# Altium schematic sheet 1_PowerSupply.SchDoc
size A4
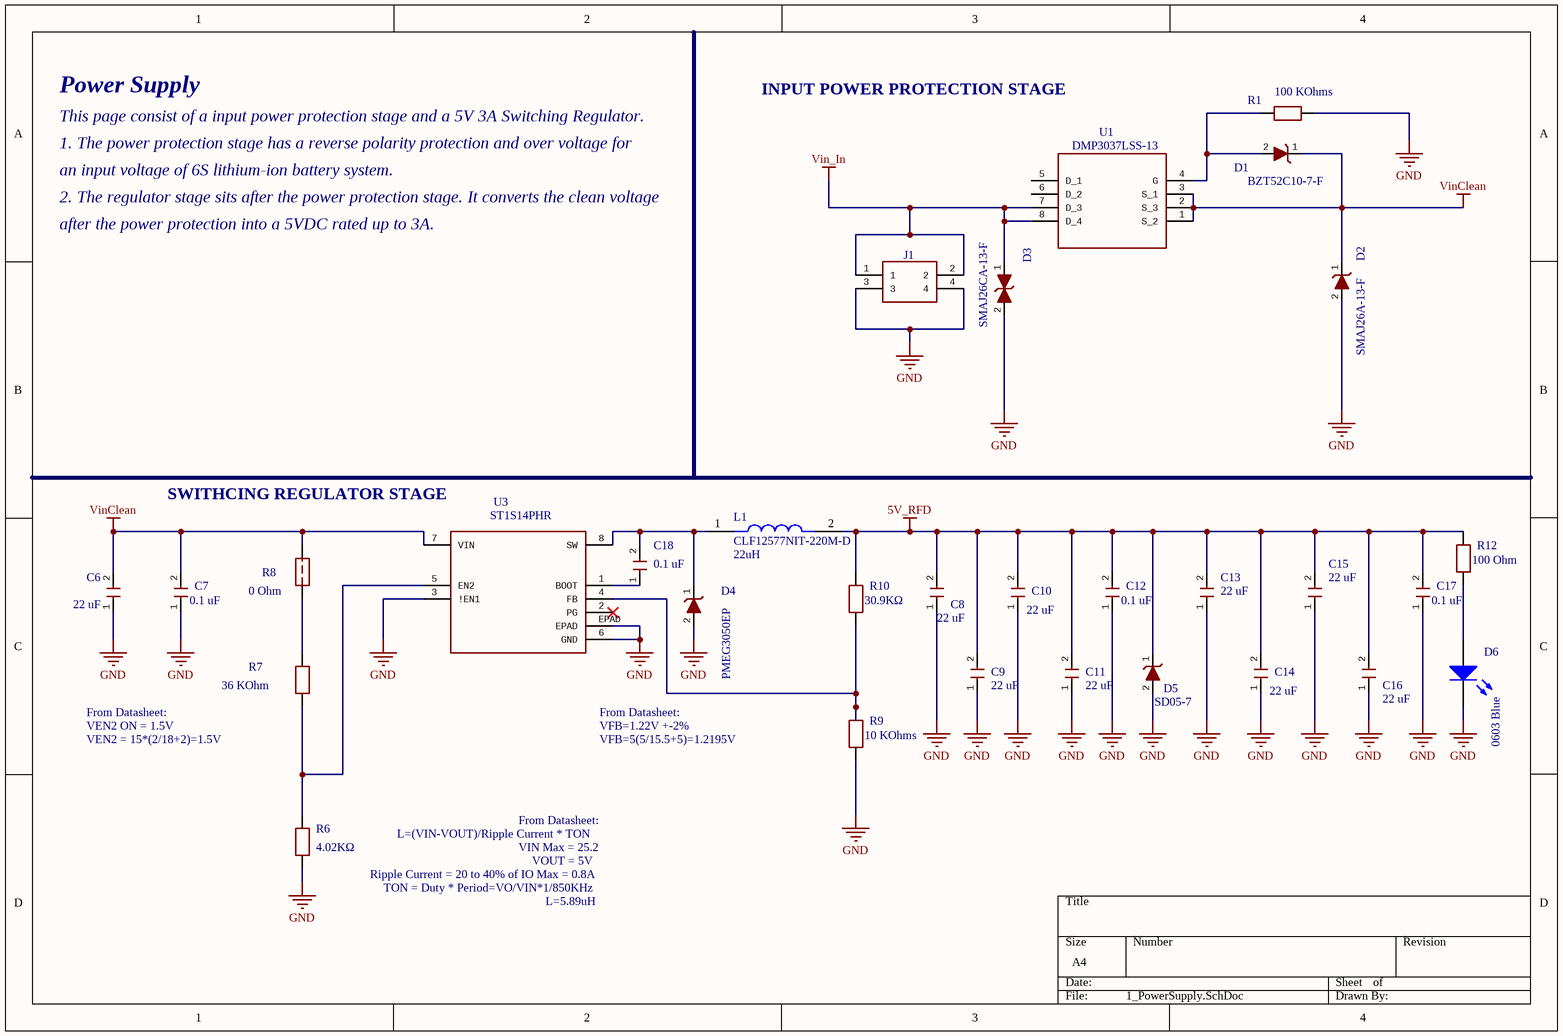
[diagram p0: 1_PowerSupply.SchDoc]

## Parts
C6  value 22 uF  [CAP_0805]  (hidden comment: C2012X5R1V226MT000E)
C7  value 0.1 uF  [CAP_0603]  (hidden comment: CL10B104KB8NNNC)
C8  value 22 uF  [CAP_0805]  (hidden comment: C2012X5R1V226MT000E)
C9  value 22 uF  [CAP_0805]  (hidden comment: C2012X5R1V226MT000E)
C10  value 22 uF  [CAP_0805]  (hidden comment: C2012X5R1V226MT000E)
C11  value 22 uF  [CAP_0805]  (hidden comment: C2012X5R1V226MT000E)
C12  value 0.1 uF  [CAP_0603]  (hidden comment: CL10B104KB8NNNC)
C13  value 22 uF  [CAP_0805]  (hidden comment: C2012X5R1V226MT000E)
C14  value 22 uF  [CAP_0805]  (hidden comment: C2012X5R1V226MT000E)
C15  value 22 uF  [CAP_0805]  (hidden comment: C2012X5R1V226MT000E)
C16  value 22 uF  [CAP_0805]  (hidden comment: C2012X5R1V226MT000E)
C17  value 0.1 uF  [CAP_0603]  (hidden comment: CL10B104KB8NNNC)
C18  value 0.1 uF  [CAP_0603]  (hidden comment: CL10B104KB8NNNC)
D1  BZT52C10-7-F  [DIODE_SOD-123]
D2  SMAJ26A-13-F  [DIODE_DO-214AC]
D3  SMAJ26CA-13-F  [DIODE_DO-214AC]
D4  PMEG3050EP  [DIODE_SOD-128]
D5  SD05-7  [DIODE_DO-214AC]
D6  0603 Blue  [0603_LED_S1]
J1  4 way r/a PCB header w/peg,Mini-Fit Jr Molex MINI-FIT JR. Series, Series Number 5569, 4.2mm Pitch 4 Way 2 Row Shrouded Right Angle PCB Header, Through Hole   Source:  Datasheet  [39-30-1040]  (value not drawn)
L1  CLF12577NIT-220M-D  value 22uH  [IND_TDK_CLF12577NIT]
R1  value 100 KOhms  [RES_0805]  (hidden comment: ERJP06J104V)
R6  value 4.02KΩ  [RES_0603]  (hidden comment: ERA3AEB4021V)
R7  value 36 KOhm  [RES_0603]  (hidden comment: ERJ3EKF3602V)
R8  value 0 Ohm  [RES_0603]  (hidden comment: ERJ3GEY0R00V)
R9  value 10 KOhms  [RES_0603]  (hidden comment: ERJ3GEYJ103V)
R10  value 30.9KΩ  [RES_0603]  (hidden comment: CRCW060330K9FKEA)
R12  value 100 Ohm  [RES_0603]  (hidden comment: ERJU3RD1000V)
U1  DMP3037LSS-13  [MOSFET_SOIC-8_150mil]
U3  ST1S14PHR  [REG_HSOP8]

## Nets
5V_RFD: C8.2 C9.2 C10.2 C11.2 C12.2 C13.2 C14.2 C15.2 C16.2 C17.2 D5.1 L1.2 R10.2 R12.2
GND: C6.1 C7.1 C8.1 C9.1 C10.1 C11.1 C12.1 C13.1 C14.1 C15.1 C16.1 C17.1 D2.2 D3.2 D4.2 D5.2 D6.K J1.3 J1.4 R1.2 R6.1 R9.1 U3.3(!EN1) U3.6(GND) U3.EPAD
Vin_In: D3.1 J1.1 J1.2 U1.7(D_3) U1.8(D_4)
VinClean: C6.2 C7.2 D1.1 D2.1 R8.2 U1.1(S_2) U1.2(S_3) U1.3(S_1) U3.7(VIN)
NetC18_1: C18.1 U3.1(BOOT)
NetC18_2: C18.2 D4.1 L1.1 U3.8(SW)
NetD1_2: D1.2 R1.1 U1.4(G)
NetD6_A: D6.A R12.1
NetR6_2: R6.2 R7.1 U3.5(EN2)
NetR7_2: R7.2 R8.1
NetR9_2: R9.2 R10.1 U3.4(FB)

Not connected (* = marked no-connect by the designer): U1 5(D_1) 6(D_2); U3 2(PG)*

## Notes on the sheet
- Power Supply
- INPUT POWER PROTECTION STAGE
- This page consist of a input power protection stage and a 5V 3A Switching Regulator.
- 1. The power protection stage has a reverse polarity protection and over voltage for
- an input voltage of 6S lithium-ion battery system.
- 2. The regulator stage sits after the power protection stage. It converts the clean voltage
- after the power protection into a 5VDC rated up to 3A.
- SWITHCING REGULATOR STAGE
- From Datasheet:
- VEN2 ON = 1.5V
- VEN2 = 15*(2/18+2)=1.5V
- VFB=1.22V +-2%
- VFB=5(5/15.5+5)=1.2195V
- L=(VIN-VOUT)/Ripple Current * TON
- VIN Max = 25.2
- Ripple Current = 20 to 40% of IO Max = 0.8A
- TON = Duty * Period=VO/VIN*1/850KHz
- VOUT = 5V
- L=5.89uH

## Library data of the parts
C6 C8-C11 C13-C16 = C2012X5R1V226MT000E: Cap Ceramic 22uF 50V 0805; Manufacturer_Part_Number: C2012X5R1V226MT000E; Link: https://www.digikey.ca/en/products/detail/tdk-corporation/C2012X5R1V226M125AC/3951664?s=N4IgTCBcDaIMJgAwEYwA0CsAlZA1MYAbALIAqiFAoiALoC%2BQA; Package: 0805; PartNumber: C2012X5R1V226MT000E; SupplierPartNumber: 445-14428-2-ND; SuppliersPartNumber: C338080
C7 C12 C17 C18 = CL10B104KB8NNNC: Cap Ceramic 0.1uF 50V 0603; Manufacturer_Name: Samsung; Link: https://www.digikey.ca/en/products/detail/samsung-electro-mechanics/CL10B104KB8NNNC/3886658?s=N4IgTCBcDaIMIBkCMAGAQqgLAaTQDgDki4QBdAXyA; Package: 0603; PartNumber: CL10B104KB8NNNC; SupplierPartNumber: 1276-1000-2-ND; SuppliersPartNumber: C1591
D1 = BZT52C10-7-F: Diode Zener 10V 370mW; Manufacturer_Name: Diodes Inc.; SymbolName_1: BZT52C10-7-F; LibraryName: BZT52C10-7-F; DeviceSetName: BZT52C10-7-F; Manufacturer_Part_Number: BZT52C10-7-F; Mouser_Part_Number: 621-BZT52C10-F; Mouser_Price-Stock: https://www.mouser.co.uk/ProductDetail/Diodes-Incorporated/BZT52C10-7-F?qs=%2F0USrAtie8G0fxvqWmtHrQ%3D%3D; Link: https://www.digikey.ca/en/products/detail/diodes-incorporated/BZT52C10-7-F/717726; Value: 10V 370mW; Package: SOD-123; PartNumber: BZT52C10-7-F; SupplierPartNumber: BZT52C10-FDITR-ND; SuppliersPartNumber: C155227
D2 = SMAJ26A-13-F: Diode TVS 26V; Mfr_Name: Diodes Inc; GateName_1: A; DeviceName: SMA_DIO; SymbolName_1: DIODE; LibraryName: 2022-09-06_21-11-13_Library; DeviceSetName: SMAJ26A-13-F; Copyright: Copyright (C) 2022 Ultra Librarian. All rights reserved.; Manufacturer_Part_Number: SMAJ26A-13-F; Digi-Key_Part_Number_1: SMAJ26A-FDICT-ND; Digi-Key_Part_Number_2: SMAJ26A-FDIDKR-ND; Digi-Key_Part_Number_3: SMAJ26A-FDITR-ND; Link: https://www.digikey.ca/en/products/detail/diodes-incorporated/SMAJ26A-13-F/806555?s=N4IgTCBcDaIMoFkCCApMA2JBaAjAZiwDEQBdAXyA; Package: DO-214AC; PartNumber: SMAJ26A-13-F; SupplierPartNumber: SMAJ26A-FDITR-ND; SuppliersPartNumber: C134975
D3 = SMAJ26CA-13-F: Diode TVS Bidirectional 26V; Mfr_Name: Diodes Inc; Manufacturer_Part_Number: SMAJ26A-13-F; Value: 26V; Link: https://www.digikey.ca/en/products/detail/diodes-incorporated/SMAJ26A-13-F/806555?s=N4IgTCBcDaIMoFkCCApMA2JBaAYgEQEkAVAJSwDk8QBdAXyA; Package: DO-214AC; PartNumber: SMAJ26CA-13-F; SupplierPartNumber: SMAJ26CA-FDITR-ND; SuppliersPartNumber: C134976
D4 = PMEG3050EP: Diode FastRecovery 30V SOD-128; Mfr_Name: Nexperia; Value: FastRecovery 30V; Link: https://www.digikey.ca/en/products/detail/nexperia-usa-inc/PMEG3050EP-115/2228695; Package: SOD-128; PartNumber: PMEG3050EP; SupplierPartNumber: 1727-5317-2-ND; SuppliersPartNumber: C134975
D5 = SD05-7: Diode TVS 5V; Mfr_Name: Diodes Inc; Value: TVS 5V; Link: https://www.digikey.ca/en/products/detail/diodes-incorporated/SD05-7/2052792; Package: SOD-323; PartNumber: SD05-7; SupplierPartNumber: SD05DITR-ND; SuppliersPartNumber: C460454
D6 = 0603 LED Blue: LED; ComponentLink1Description: 供应商链接; ComponentLink1URL: http://www.szlcsc.com/product/details_73150.html; Package: 0603; Supplier: LC; SuppliersPartNumber: C72041; Color: Blue
J1 = 39-30-1040: GateName_1: G$1; SymbolName_1: 39-30-1040; LibraryName: 39-30-1040; DeviceSetName: 39-30-1040; Manufacturer_Name: Molex; Manufacturer_Part_Number: 39-30-1040; Mouser_Part_Number: 538-39-30-1040; Mouser_Price-Stock: https://www.mouser.co.uk/ProductDetail/Molex/39-30-1040?qs=tRPrwvvr%2FugKtPXHFlZTbg%3D%3D; Height: mm
L1 = CLF12577NIT-220M-D: Ind 22uH Shielded Drum Core 4.5A; Manufacturer: TDK; PartNumber: CLF12577NIT-220M-D; Package: NON STANDARD-2 TDK; Link: https://www.digikey.ca/en/products/detail/tdk-corporation/CLF12577NIT-220M-D/6236873?s=N4IgTCBcDaIMIBkBiBGMBWA7JgcgSQBUBaMMABgFkiAREAXQF8g; SupplierPartNumber: 445-174735-2-ND; SuppliersPartNumber: C138319
R1 = ERJP06J104V: Res 100KOhms 1/2W 0805; Link: https://www.digikey.ca/en/products/detail/panasonic-electronic-components/ERJ-P06J104V/525199?s=N4IgTCBcDaIKICUBSAFADANiQRjQFgDUQBdAXyA; Package: 0805; PartNumber: ERJP06J104V; SupplierPartNumber: P100KADTR-ND; SuppliersPartNumber: C441960
R6 = ERA3AEB4021V: Res 4.02KOhm 1/10W 0603; Manufacturer_Name: Panasonic; PartNumber: ERJ3GEYJ200V; Link: https://www.digikey.ca/en/products/detail/panasonic-electronic-components/ERA-3AEB4021V/2026802?s=N4IgTCBcDaIKICUCCBmJcBCAWADGAjAGogC6AvkA; Package: 0603; SupplierPartNumber: P4.02KDBTR-ND; SuppliersPartNumber: C491130
R7 = ERJ3EKF3602V: Res 36KOhm 1/10W 0603; Manufacturer_Name: Panasonic; Link: https://www.digikey.ca/en/products/detail/panasonic-electronic-components/ERJ-3EKF3602V/1746389?s=N4IgTCBcDaIKICUBSBmOBpAYigbABjADUQBdAXyA; Package: 0603; PartNumber: ERJ3EKF3602V; SupplierPartNumber: P36.0KHTR-ND; SuppliersPartNumber: C403181
R8 = ERJ3GEY0R00V: Res 0Ohm 1/10W 0603; Link: https://www.digikey.ca/en/products/detail/panasonic-electronic-components/ERJ-3GEY0R00V/135656?s=N4IgTCBcDaIKICUBSBmA4nAmgBgd7AaiALoC%2BQA; Package: 0603; SupplierPartNumber: P0.0GTR-ND; SuppliersPartNumber: C122704; PartNumber: ERJ3GEY0R00V
R9 = ERJ3GEYJ103V: Res 10KOhms 1/10W 0603; Link: https://www.mouser.ca/ProductDetail/Panasonic/ERJ-3GEYJ103V?qs=66DK8nO8gJBWgc%252B0VNNxzg%3D%3D; Package: 0603; PartNumber: ERJ3GEYJ103V; SupplierPartNumber: 667-ERJ-3GEYJ103V; SuppliersPartNumber: C169849
R10 = CRCW060330K9FKEA: Res 30.9KOhm 1/10W 0603; Manufacturer_Name: Vishay Intertech; Link: https://www.digikey.ca/en/products/detail/vishay-dale/CRCW060330K9FKEAHP/2222269; Package: 0603; SupplierPartNumber: 541-30.9KSTR-ND; SuppliersPartNumber: C844354; PartNumber: CRCW060330K9FKEA
R12 = ERJU3RD1000V: Res 100Ohm 1/10W 0603; Manufacturer_Name: Panasonic; Link: https://www.digikey.ca/en/products/detail/panasonic-electronic-components/ERJ-U3RD1000V/12549636?s=N4IgTCBcDaIKICUBSBVAzAgIgRgAz4DUQBdAXyA; Package: 0603; SupplierPartNumber: 10-ERJ-U3RD1000VTR-ND; SuppliersPartNumber: C491168; PartNumber: ERJU3RD1000V
U1 = DMP3037LSS-13: P-Channel 30V 5.8A; PartNumber: Diodes Inc; SupplierPartNumber: DMP3037LSS-13DITR-ND; Link: https://www.digikey.ca/en/products/detail/diodes-incorporated/DMP3037LSS-13/4869019?s=N4IgTCBcDaICIFkAKBmADCg7AGQMq4FoBGFEAXQF8g; SuppliersPartNumber: C150501; Value: 30V 5.8A; Package: SOIC-8_150mil
U3 = ST1S14PHR: Switching Step-down; Mfr_Name: STMicroelectronics; DeviceSetName: ST1S14PHR; Manufacturer_Part_Number: ST1S14PHR; Value: Switching Step-down; Link: https://www.digikey.ca/en/products/detail/stmicroelectronics/ST1S14PHR/2469146?s=N4IgTCBcDaIMoBUCMckBYAKAJASiAugL5A; Package: HSOP-8; PartNumber: ST1S14PHR; SupplierPartNumber: 497-10816-2-ND; SuppliersPartNumber: C84130